# EAGLE design SensorNodePCB_set1_v2_wo_Relay (EAGLE 7.7.0)
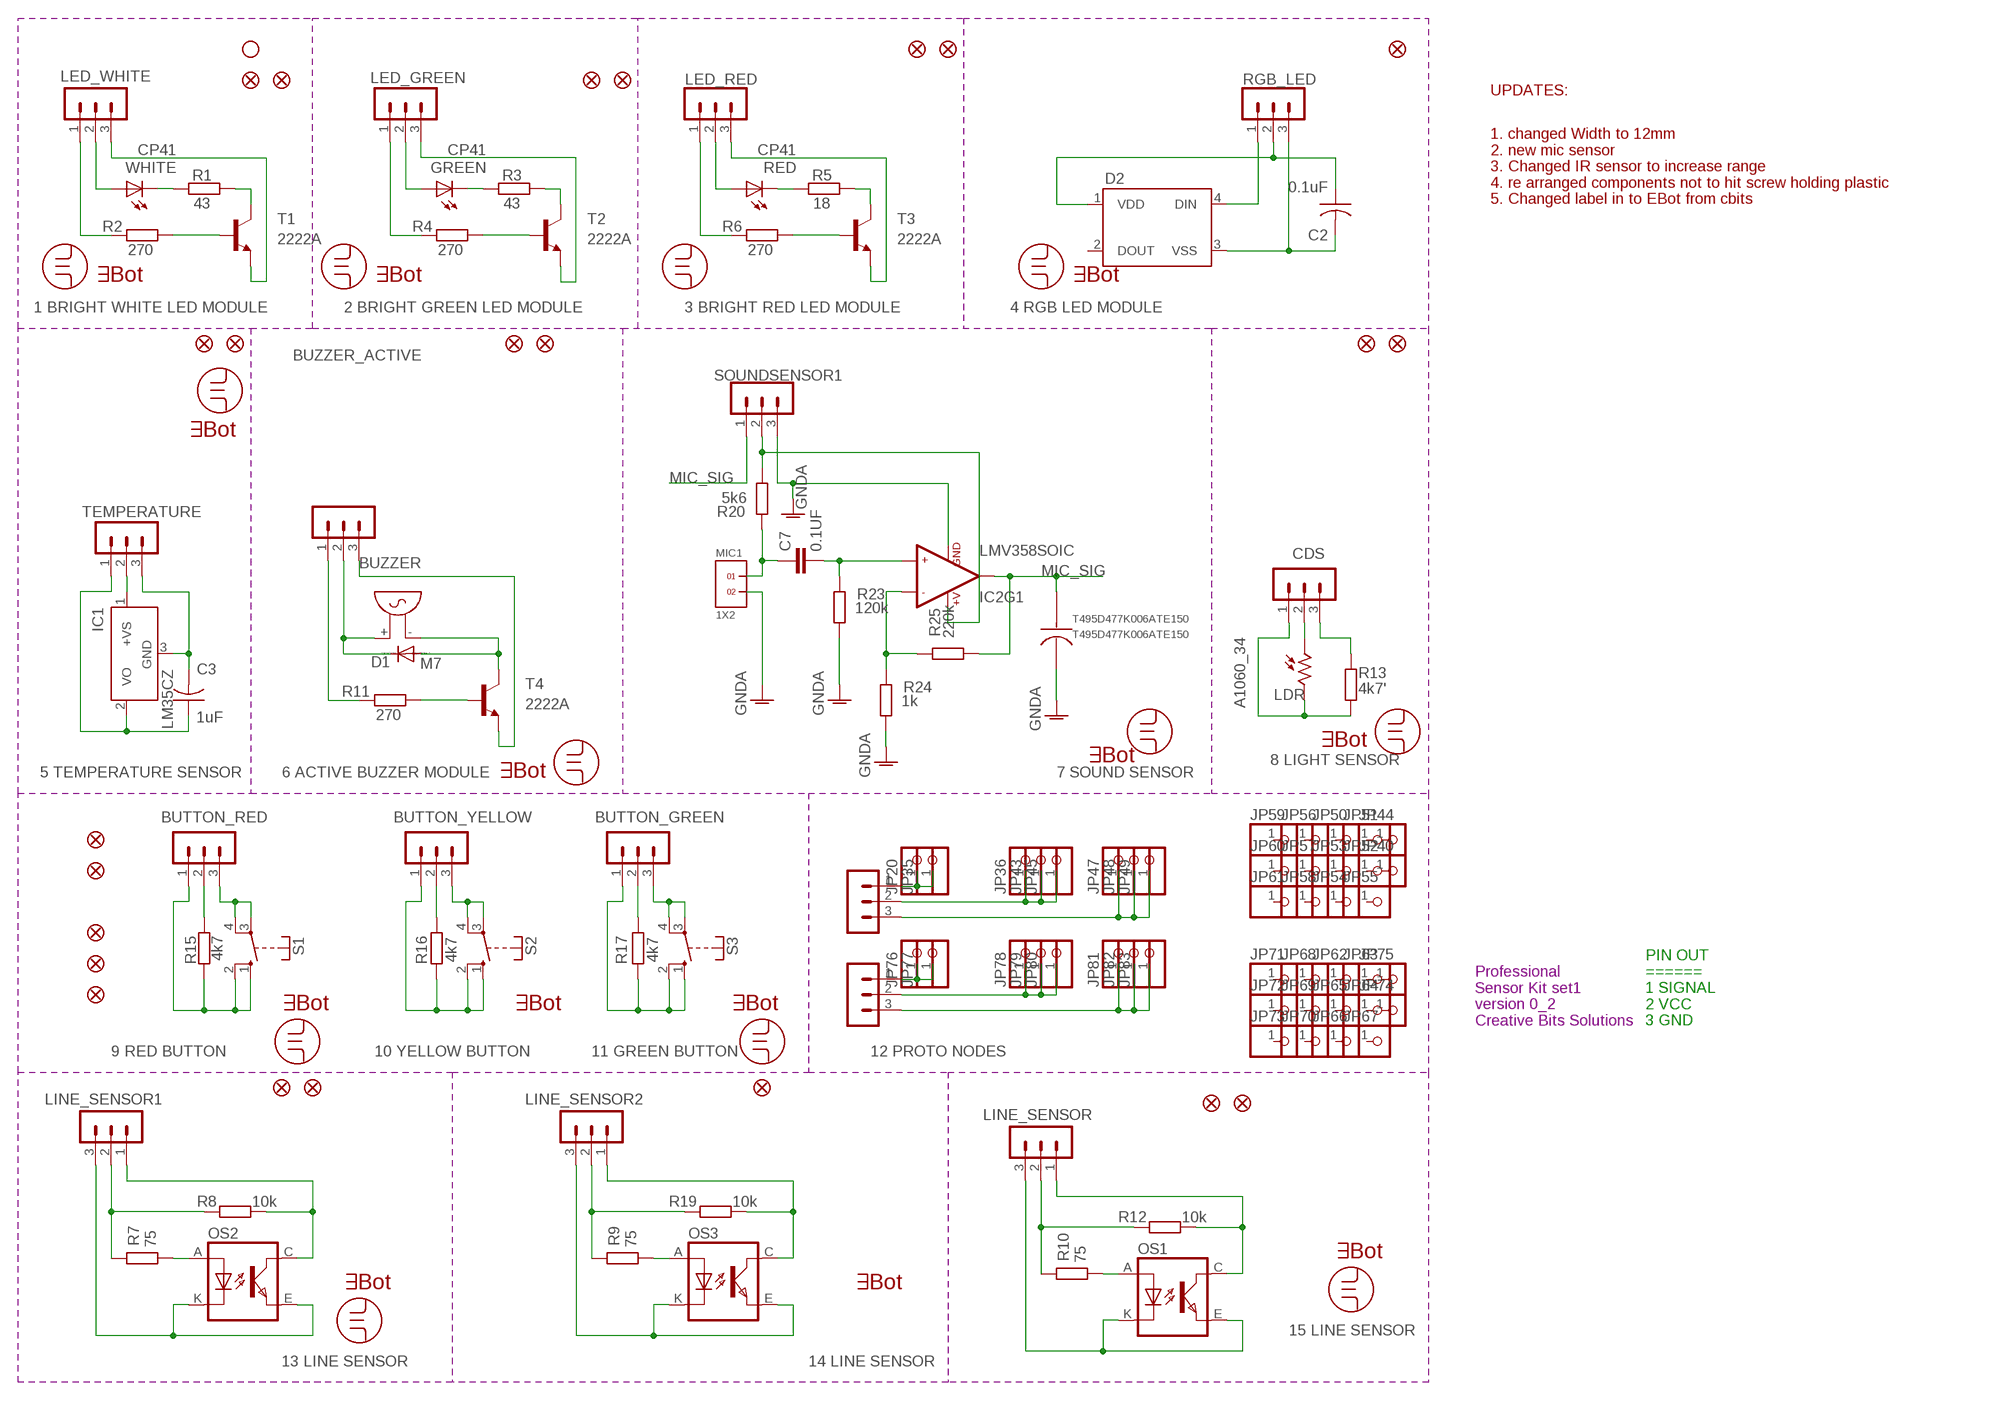
[diagram p0: schematic, sheet 1]

## Parts
BUTTON_GREEN  MA03-1  [MA03-1]
BUTTON_RED  MA03-1  [MA03-1]
BUTTON_YELLOW  MA03-1  [MA03-1]
BUZZER  F/QMX  [F/QMX]
BUZZER_ACTIVE  MA03-1  [MA03-1]
C2  0.1uF  C-USC0805  [C0805]
C3  1uF  C-USC0805  [C0805]
C7  0.1UF  CAP0805  [0805]
CDS  MA03-1  [MA03-1]
D1  M7  DIODE-DO214AC  [DO214AC]
D2  WS2812B  [WS2812B]
GREEN  CP41  LED-2AC-CP41B-WES  [CP41B]
IC1  LM35CZ  [TO92]
IC2  LMV358SOIC  [SO08]
JP1  STAND-OFF  [STAND-OFF]
JP2  FIDUCIAL1X2  [FIDUCIAL-1X2]
JP4  FIDUCIAL1X2  [FIDUCIAL-1X2]
JP6  FIDUCIAL1X2  [FIDUCIAL-1X2]
JP7  FIDUCIAL1X2  [FIDUCIAL-1X2]
JP12  FIDUCIAL1X2  [FIDUCIAL-1X2]
JP18  FIDUCIAL1X2  [FIDUCIAL-1X2]
JP19  FIDUCIAL1X2  [FIDUCIAL-1X2]
JP20  PINHD-1X1CB  [1X01-CLEANBIG]
JP23  FIDUCIAL1X2  [FIDUCIAL-1X2]
JP24  FIDUCIAL1X2  [FIDUCIAL-1X2]
JP25  FIDUCIAL1X2  [FIDUCIAL-1X2]
JP26  FIDUCIAL1X2  [FIDUCIAL-1X2]
JP28  FIDUCIAL1X2  [FIDUCIAL-1X2]
JP29  FIDUCIAL1X2  [FIDUCIAL-1X2]
JP31  FIDUCIAL1X2  [FIDUCIAL-1X2]
JP32  FIDUCIAL1X2  [FIDUCIAL-1X2]
JP33  FIDUCIAL1X2  [FIDUCIAL-1X2]
JP34  FIDUCIAL1X2  [FIDUCIAL-1X2]
JP35  PINHD-1X1CB  [1X01-CLEANBIG]
JP36  PINHD-1X1CB  [1X01-CLEANBIG]
JP37  FIDUCIAL1X2  [FIDUCIAL-1X2]
JP38  FIDUCIAL1X2  [FIDUCIAL-1X2]
JP39  FIDUCIAL1X2  [FIDUCIAL-1X2]
JP40  PINHD-1X1CB  [1X01-CLEANBIG]
JP41  FIDUCIAL1X2  [FIDUCIAL-1X2]
JP42  FIDUCIAL1X2  [FIDUCIAL-1X2]
JP43  PINHD-1X1CB  [1X01-CLEANBIG]
JP44  PINHD-1X1CB  [1X01-CLEANBIG]
JP45  PINHD-1X1CB  [1X01-CLEANBIG]
JP46  FIDUCIAL1X2  [FIDUCIAL-1X2]
JP47  PINHD-1X1CB  [1X01-CLEANBIG]
JP48  PINHD-1X1CB  [1X01-CLEANBIG]
JP49  PINHD-1X1CB  [1X01-CLEANBIG]
JP50  PINHD-1X1CB  [1X01-CLEANBIG]
JP51  PINHD-1X1CB  [1X01-CLEANBIG]
JP52  PINHD-1X1CB  [1X01-CLEANBIG]
JP53  PINHD-1X1CB  [1X01-CLEANBIG]
JP54  PINHD-1X1CB  [1X01-CLEANBIG]
JP55  PINHD-1X1CB  [1X01-CLEANBIG]
JP56  PINHD-1X1CB  [1X01-CLEANBIG]
JP57  PINHD-1X1CB  [1X01-CLEANBIG]
JP58  PINHD-1X1CB  [1X01-CLEANBIG]
JP59  PINHD-1X1CB  [1X01-CLEANBIG]
JP60  PINHD-1X1CB  [1X01-CLEANBIG]
JP61  PINHD-1X1CB  [1X01-CLEANBIG]
JP62  PINHD-1X1CB  [1X01-CLEANBIG]
JP63  PINHD-1X1CB  [1X01-CLEANBIG]
JP64  PINHD-1X1CB  [1X01-CLEANBIG]
JP65  PINHD-1X1CB  [1X01-CLEANBIG]
JP66  PINHD-1X1CB  [1X01-CLEANBIG]
JP67  PINHD-1X1CB  [1X01-CLEANBIG]
JP68  PINHD-1X1CB  [1X01-CLEANBIG]
JP69  PINHD-1X1CB  [1X01-CLEANBIG]
JP70  PINHD-1X1CB  [1X01-CLEANBIG]
JP71  PINHD-1X1CB  [1X01-CLEANBIG]
JP72  PINHD-1X1CB  [1X01-CLEANBIG]
JP73  PINHD-1X1CB  [1X01-CLEANBIG]
JP74  PINHD-1X1CB  [1X01-CLEANBIG]
JP75  PINHD-1X1CB  [1X01-CLEANBIG]
JP76  PINHD-1X1CB  [1X01-CLEANBIG]
JP77  PINHD-1X1CB  [1X01-CLEANBIG]
JP78  PINHD-1X1CB  [1X01-CLEANBIG]
JP79  PINHD-1X1CB  [1X01-CLEANBIG]
JP80  PINHD-1X1CB  [1X01-CLEANBIG]
JP81  PINHD-1X1CB  [1X01-CLEANBIG]
JP82  PINHD-1X1CB  [1X01-CLEANBIG]
JP83  PINHD-1X1CB  [1X01-CLEANBIG]
LDR  A1060_34  [T0-46-A10XX]
LED_GREEN  MA03-1  [MA03-1]
LED_RED  MA03-1  [MA03-1]
LED_WHITE  MA03-1  [MA03-1]
LINE_SENSOR  MA03-1  [MA03-1]
LINE_SENSOR1  MA03-1  [MA03-1]
LINE_SENSOR2  MA03-1  [MA03-1]
MIC1  1X2  [1X2]
OS1  TCRT5000  [TCRT5000]
OS2  TCRT5000  [TCRT5000]
OS3  TCRT5000  [TCRT5000]
R1  43  R-EU_R0805  [R0805]
R2  270  R-EU_R0805  [R0805]
R3  43  R-EU_R0805  [R0805]
R4  270  R-EU_R0805  [R0805]
R5  18  R-EU_R0805  [R0805]
R6  270  R-EU_R0805  [R0805]
R7  75  R-EU_R0805  [R0805]
R8  10k  R-EU_R0805  [R0805]
R9  75  R-EU_R0805  [R0805]
R10  75  R-EU_R0805  [R0805]
R11  270  R-EU_R0805  [R0805]
R12  10k  R-EU_R0805  [R0805]
R13  4k7'  R-EU_R0805  [R0805]
R15  4k7  R-EU_R0805  [R0805]
R16  4k7  R-EU_R0805  [R0805]
R17  4k7  R-EU_R0805  [R0805]
R19  10k  R-EU_R0805  [R0805]
R20  5k6  R-EU_R0805  [R0805]
R23  120k  R-EU_R0805  [R0805]
R24  1k  R-EU_R0805  [R0805]
R25  220k  R-EU_R0805  [R0805]
RED  CP41  LED-2AC-CP41B-WES  [CP41B]
RGB_LED  MA03-1  [MA03-1]
S1  RACON12  [RACON12]
S2  RACON12  [RACON12]
S3  RACON12  [RACON12]
SOUNDSENSOR1  MA03-1  [MA03-1]
T1  2222A  TRANSISTOR_NPNMMBT2222A  [SOT23-3]
T2  2222A  TRANSISTOR_NPNMMBT2222A  [SOT23-3]
T3  2222A  TRANSISTOR_NPNMMBT2222A  [SOT23-3]
T4  2222A  TRANSISTOR_NPNMMBT2222A  [SOT23-3]
TEMPERATURE  MA03-1  [MA03-1]
U$1  EBOT_LOGO_6MMX6MM  [EBOT_6MMX6MM]
U$3  EBOT_LOGO_6MMX6MM  [EBOT_6MMX6MM]
U$4  EBOT_LOGO_6MMX6MM  [EBOT_6MMX6MM]
U$6  EBOT_LOGO_6MMX6MM  [EBOT_6MMX6MM]
U$8  EBOT_LOGO_6MMX6MM  [EBOT_6MMX6MM]
U$9  EBOT_LOGO_6MMX6MM  [EBOT_6MMX6MM]
U$10  EBOT_LOGO_6MMX6MM  [EBOT_6MMX6MM]
U$11  T495D477K006ATE150  [T495D477K006ATE150]
U$12  EBOT_LOGO_6MMX6MM  [EBOT_6MMX6MM]
U$13  EBOT_LOGO_6MMX6MM  [EBOT_6MMX6MM]
U$14  EBOT_LOGO_6MMX6MM  [EBOT_6MMX6MM]
U$15  EBOT_LOGO_6MMX6MM  [EBOT_6MMX6MM]
U$16  EBOT_LOGO_6MMX6MM  [EBOT_6MMX6MM]
U$17  EBOT_NAME_6MM  [EBOT_NAME_6MM]
U$18  EBOT_NAME_6MM  [EBOT_NAME_6MM]
U$20  EBOT_NAME_6MM  [EBOT_NAME_6MM]
U$21  EBOT_NAME_6MM  [EBOT_NAME_6MM]
U$22  EBOT_NAME_6MM  [EBOT_NAME_6MM]
U$23  EBOT_NAME_6MM  [EBOT_NAME_6MM]
U$24  EBOT_NAME_6MM  [EBOT_NAME_6MM]
U$25  EBOT_NAME_6MM  [EBOT_NAME_6MM]
U$26  EBOT_NAME_6MM  [EBOT_NAME_6MM]
U$27  EBOT_NAME_6MM  [EBOT_NAME_6MM]
U$29  EBOT_NAME_6MM  [EBOT_NAME_6MM]
U$30  EBOT_NAME_6MM  [EBOT_NAME_6MM]
U$31  EBOT_NAME_6MM  [EBOT_NAME_6MM]
ULTRASONICSENSOR1  MA03-1  [MA03-1]
ULTRASONICSENSOR2  MA03-1  [MA03-1]
WHITE  CP41  LED-2AC-CP41B-WES  [CP41B]

## Nets
GNDA: IC2.4(GND) MIC1.2 R23.1 R24.1 SOUNDSENSOR1.3 U$11.-
MIC_SIG: IC2.1(OUT1) R25.1 SOUNDSENSOR1.1 U$11.+
N$1: LED_WHITE.1 R2.2
N$2: R2.1 T1.1(B)
N$3: R1.2 WHITE.1(C) WHITE.4(C)
N$4: R1.1 T1.3(C)
N$5: R4.1 T2.1(B)
N$6: LED_WHITE.2 WHITE.2(A) WHITE.3(A)
N$7: GREEN.1(C) GREEN.4(C) R3.2
N$8: LED_GREEN.1 R4.2
N$9: R3.1 T2.3(C)
N$10: GREEN.2(A) GREEN.3(A) LED_GREEN.2
N$11: R6.1 T3.1(B)
N$12: R5.2 RED.1(C) RED.4(C)
N$13: LED_RED.1 R6.2
N$14: R5.1 T3.3(C)
N$15: LED_RED.2 RED.2(A) RED.3(A)
N$16: D2.4(DIN) RGB_LED.1
N$17: C2.1 D2.1(VDD) RGB_LED.2
N$18: C2.2 D2.3(VSS) RGB_LED.3
N$19: BUTTON_RED.1 R15.2 S1.1(S) S1.2(S)
N$20: BUTTON_RED.2 R15.1
N$21: BUTTON_YELLOW.1 R16.2 S2.1(S) S2.2(S)
N$22: LED_WHITE.3 T1.2(E)
N$23: JP20.1 JP35.1 ULTRASONICSENSOR1.1
N$24: R11.1 T4.1(B)
N$25: LED_GREEN.3 T2.2(E)
N$26: LED_RED.3 T3.2(E)
N$27: IC1.1(+VS) TEMPERATURE.2
N$28: BUZZER_ACTIVE.1 R11.2
N$29: BUZZER.- D1.A T4.3(C)
N$30: BUZZER.+ BUZZER_ACTIVE.2 D1.C
N$31: BUZZER_ACTIVE.3 T4.2(E)
N$32: C3.2 IC1.3(GND) TEMPERATURE.3
N$33: C3.1 IC1.2(VO) TEMPERATURE.1
N$34: LINE_SENSOR.3 OS1.E(EMITTER) OS1.K(CATHODE)
N$35: LINE_SENSOR.2 R10.1 R12.1
N$36: OS1.A(ANODE) R10.2
N$37: CDS.1 LDR.2 R13.2
N$38: CDS.2 LDR.1
N$39: CDS.3 R13.1
N$40: LINE_SENSOR.1 OS1.C(COLLECTOR) R12.2
N$41: JP36.1 JP43.1 JP45.1 ULTRASONICSENSOR1.2
N$42: JP47.1 JP48.1 JP49.1 ULTRASONICSENSOR1.3
N$43: JP76.1 JP77.1 ULTRASONICSENSOR2.1
N$44: BUTTON_GREEN.1 R17.2 S3.1(S) S3.2(S)
N$46: BUTTON_GREEN.3 S3.3(P) S3.4(P)
N$47: JP78.1 JP79.1 JP80.1 ULTRASONICSENSOR2.2
N$48: BUTTON_YELLOW.2 R16.1
N$49: JP81.1 JP82.1 JP83.1 ULTRASONICSENSOR2.3
N$50: BUTTON_GREEN.2 R17.1
N$57: LINE_SENSOR1.3 OS2.E(EMITTER) OS2.K(CATHODE)
N$58: LINE_SENSOR1.2 R7.1 R8.1
N$59: LINE_SENSOR1.1 OS2.C(COLLECTOR) R8.2
N$62: OS2.A(ANODE) R7.2
N$63: LINE_SENSOR2.3 OS3.E(EMITTER) OS3.K(CATHODE)
N$64: LINE_SENSOR2.2 R9.1 R19.1
N$65: LINE_SENSOR2.1 OS3.C(COLLECTOR) R19.2
N$66: OS3.A(ANODE) R9.2
N$67: BUTTON_YELLOW.3 S2.3(P) S2.4(P)
N$68: IC2.8(+V) R20.1 SOUNDSENSOR1.2
N$69: C7.1 MIC1.1 R20.2
N$70: BUTTON_RED.3 S1.3(P) S1.4(P)
N$71: C7.2 IC2.3(+IN1) R23.2
N$72: IC2.2(-IN1) R24.2 R25.2
Unconnected: D2.2(DOUT) IC2.5(+IN2) IC2.6(-IN2) IC2.7(OUT2) JP40.1 JP44.1 JP50.1 JP51.1 JP52.1 JP53.1 JP54.1 JP55.1 JP56.1 JP57.1 JP58.1 JP59.1 JP60.1 JP61.1 JP62.1 JP63.1 JP64.1 JP65.1 JP66.1 JP67.1 JP68.1 JP69.1 JP70.1 JP71.1 JP72.1 JP73.1 JP74.1 JP75.1

## Notes on the sheet
- UPDATES:
- 1. changed Width to 12mm
  2. new mic sensor
  3. Changed IR sensor to increase range
  4. re arranged components not to hit screw holding plastic
  5. Changed label in to EBot from cbits
- 1 BRIGHT WHITE LED MODULE | 2 BRIGHT GREEN LED MODULE | 3 BRIGHT RED LED MODULE | 4 RGB LED MODULE
- 8 LIGHT SENSOR
- 5 TEMPERATURE SENSOR | 6 ACTIVE BUZZER MODULE | 7 SOUND SENSOR
- Professional
  Sensor Kit set1
  version 0_2
  Creative Bits Solutions
- PIN OUT
  ======
  1 SIGNAL
  2 VCC
  3 GND
- 9 RED BUTTON | 10 YELLOW BUTTON | 11 GREEN BUTTON | 12 PROTO NODES
- 15 LINE SENSOR
- 13 LINE SENSOR | 14 LINE SENSOR

## Library data of the parts
BUTTON_GREEN BUTTON_RED BUTTON_YELLOW BUZZER_ACTIVE CDS LED_GREEN LED_RED LED_WHITE LINE_SENSOR LINE_SENSOR1 LINE_SENSOR2 RGB_LED SOUNDSENSOR1 TEMPERATURE ULTRASONICSENSOR1 ULTRASONICSENSOR2 = con-lstb:MA03-1: PIN HEADER; OC_FARNELL: unknown; OC_NEWARK: unknown
BUZZER = buzzer:F/QMX: BUZZER Source: Buerklin; OC_FARNELL: unknown; OC_NEWARK: unknown
C2 C3 = adafruit:C-US: CAPACITOR, American symbol
C7 = SparkFun:CAP: Capacitor Standard 0603 ceramic capacitor, and 0.1" leaded capacitor.
D1 = diode:DIODE-: DIODE
D2 = WS2812BSparkFun-LED:WS2812B: WS2812B - Intelligent control LED integrated light source Technical Specifications: Power Supply Voltage (VDD): 3.5 to 5.3 V Input Voltage (VI): -0.5 to VDD+0.5 V Operating Junction Temperature (Topt): -25°C to +80°C Storage Temperature Range (Tstg): -55°C to +150°C; PROD_ID: DIO-12503
GREEN RED WHITE = led:LED-2AC-: LEDs with 2 Cathode & 2 Anode - Kingbright SUPER FLUX LED LAMP Source: www.us.kingbright.com/images/catalog/SPEC/W7676CPBC-H.pdf Cree® P4 LED CP41B-WES/WGS Source: Data sheet <http://www.cree.com/products/pdf/LEDlamps/CP41B-WES&WGS.pdf>
IC1 = lm35:LM35: Single-Supply Centigrade Temperature Sensor Vout = (10mV/°C x Temp °C) +5mmmV Source: http://www.national.com/ds/LM/LM35.pdf
IC2 = SparkFun-AnalogIC:LMV358: Jellybean rail-to-rail output op-amp; PROD_ID: IC-09657
JP1 = WS2812BSparkFun:STAND-OFF: Stand Off This is the mechanical footprint for a #4 phillips button head screw. Use the keepout ring to avoid running the screw head into surrounding components. SKU : PRT-00447
JP2 JP4 JP6 JP7 JP12 JP18 JP19 JP23-JP26 JP28 JP29 JP31-JP34 JP37-JP39 JP41 JP42 JP46 = attiny84SparkFun:FIDUCIAL: Fiducial Alignment Points Various fiducial points for machine vision alignment.
JP20 JP35 JP36 JP40 JP43-JP45 JP47-JP83 = adafruit:PINHD-1X1: Pin header 1x1 for 0.1" spacing With round pins
LDR = photo-elements:A10: Sensor Robust Light Sensing Applications Outdoor Light Sensing Application Source: http://optoelectronics.perkinelmer.com/content/Datasheets/DTS_PhotocellsA1050.pdf
MIC1 = headers(.1in):1X2
OS1-OS3 = tcrt5000:TCRT5000
R1-R13 R15-R17 R19 R20 R23-R25 = resistor:R-EU_: RESISTOR, European symbol
S1-S3 = switch-misc:RACON12: ITT SWITCH
T1-T4 = SparkFun-DiscreteSemi:TRANSISTOR_NPN: Generic NPN BJT MMBT2222A - TRANS-08049 (SOT-23, 1A 40V) MPSA42 - TRANS-09116 (SOT-23, 500mA 300V) MMBT5088LT1G - TRANS-11160 (SOT-23, 50 mA 30V) BC547 - COM-08928 <http://www.sparkfun.com/products/8928> (TO-92 45V 100mA) (1.Collector 2.Base 3.Emitter) 2N3904 - COM-00521 <http://www.sparkfun.com/products/521> (TO-92 40V 200mA) (1.Emitter 2.Base 3.Collector) P2N2222A - COM-12852 <http://www.sparkfun.com/products/12852> (TO-92 40V 600mA) (1.Collector 2.Base 3.Emitter); PROD_ID: TRANS-08049; VALUE: MMBT2222A
U$1 U$3 U$4 U$6 U$8-U$10 U$12-U$16 = EbotLogos:EBOT_LOGO_6MMX6MM
U$11 = creativeBits:T495D477K006ATE150
U$17 U$18 U$20-U$27 U$29-U$31 = EbotLogos:EBOT_NAME_6MM

## Net classes
0 default: width 0.178 mm, drill 0.305 mm, clearance 0.178 mm

## Board
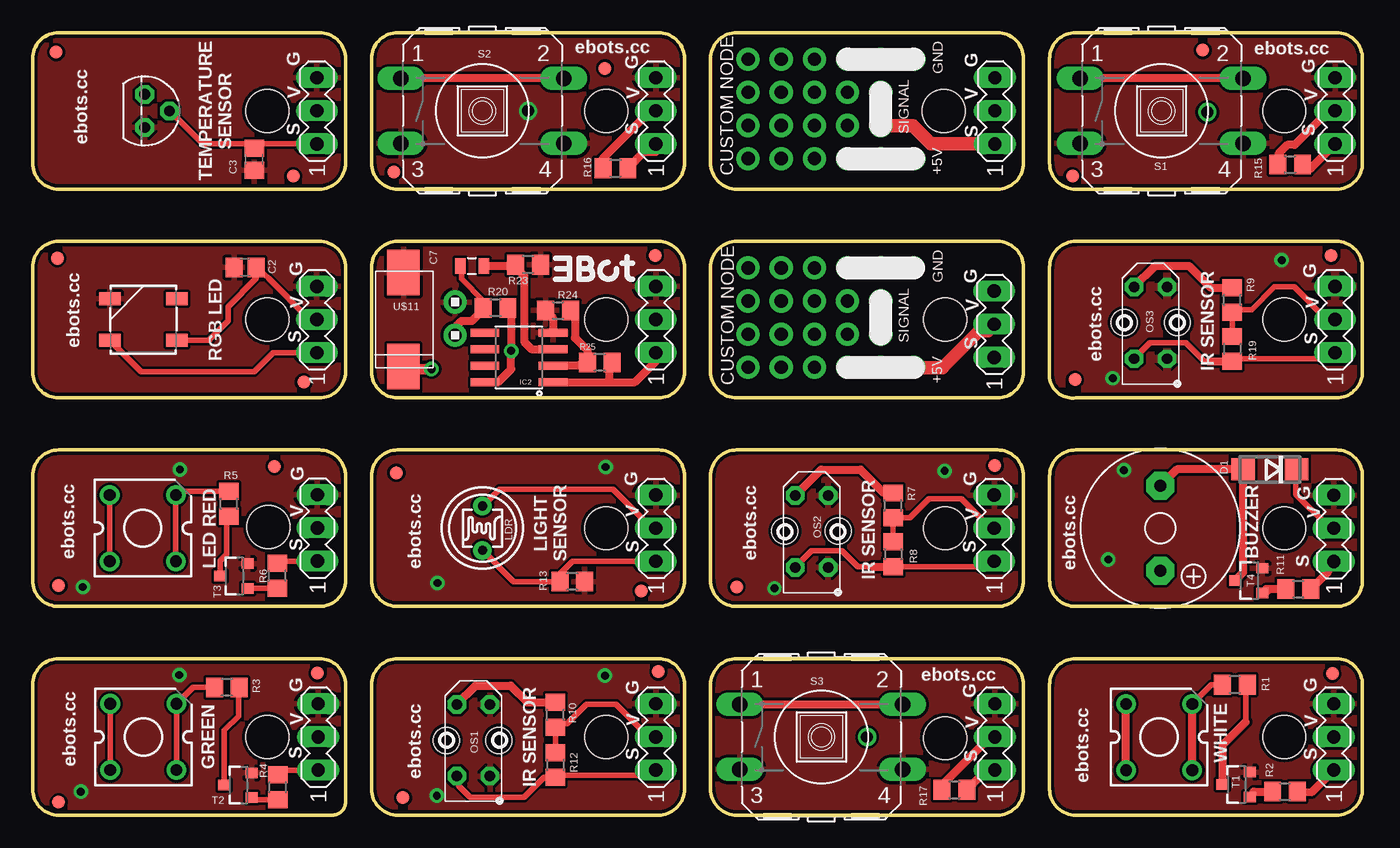
[diagram p1: board, top side]
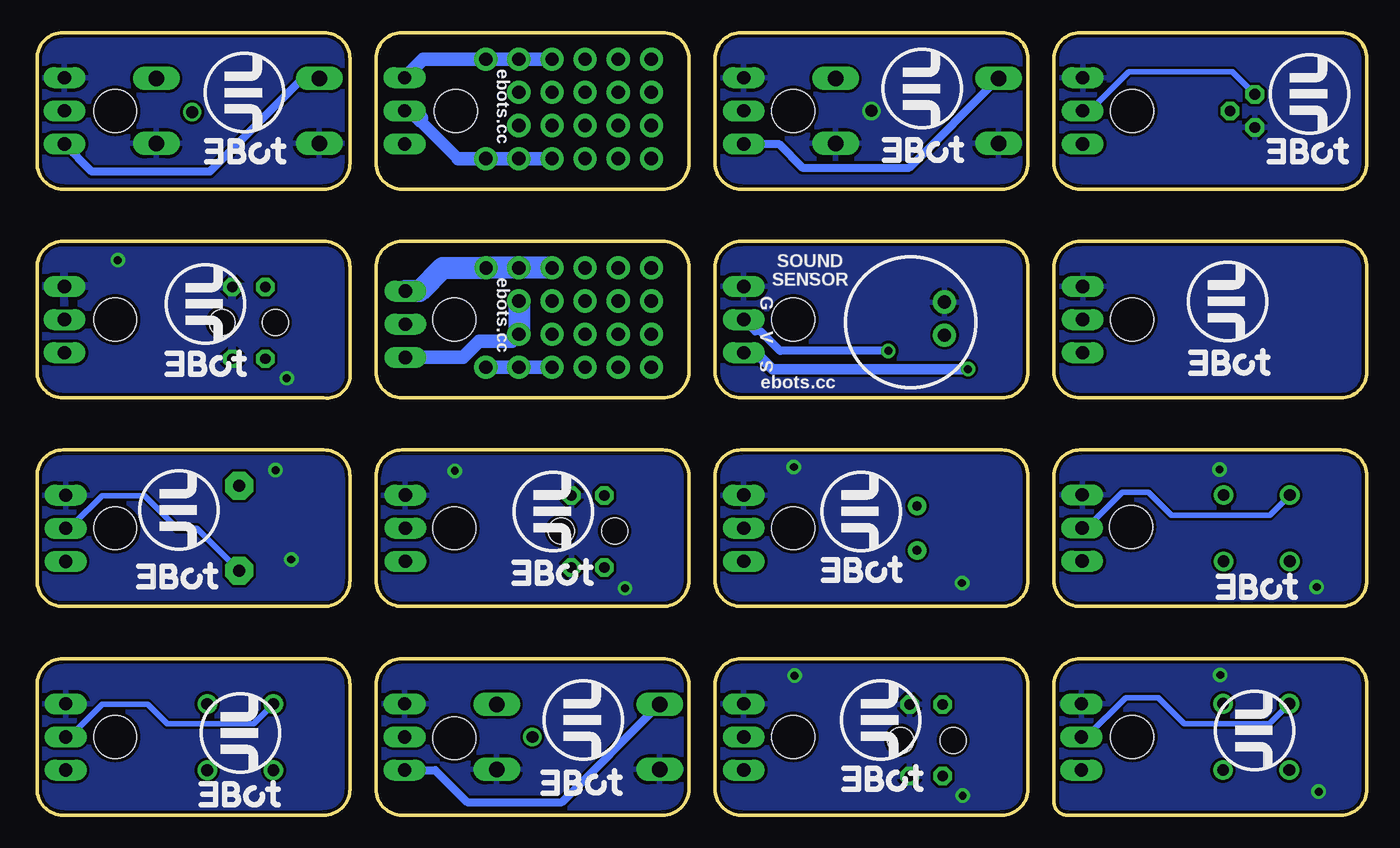
[diagram p2: board, bottom side, seen from below]

Size 102 x 60 mm. Coordinates in mm from the lower left corner, seen from the top.
Outline: 102,34 arc-90 100,32 80,32 arc-90 78,33.5 78,42 arc-90 80,44 100,44 arc-90 102,42 102,34
Outline: 78,2 78,10 arc-90 80,12 100,12 arc-90 102,10 102,2 arc-90 100,0 80,0 arc-90 78,2
Outline: 0,2 0,10 arc-90 2,12 22,12 arc-90 24,10 24,1 arc-90 23,0 2,0 arc-90 0,2
Outline: 0,18 0,26 arc-90 2,28 22,28 arc-90 24,26 24,18 arc-90 22,16 2,16 arc-90 0,18
Outline: 0,34 0,42 arc-90 2,44 22,44 arc-90 24,42 24,34 arc-90 22,32 2,32 arc-90 0,34
Outline: 26,34 26,42 arc-90 28,44 48,44 arc-90 50,42 50,34 arc-90 48,32 28,32 arc-90 26,34
Outline: 52,2 52,10 arc-90 54,12 74,12 arc-90 76,10 76,2 arc-90 74,0 54,0 arc-90 52,2
Outline: 26,50 26,58 arc-90 28,60 48,60 arc-90 50,58 50,50 arc-90 48,48 28,48 arc-90 26,50
Outline: 78,50 78,58 arc-90 80,60 100,60 arc-90 102,58 102,50 arc-90 100,48 80,48 arc-90 78,50
Outline: 28,28 48,28 arc-90 50,26 50,18 arc-90 48,16 28,16 arc-90 26,18 26,26 arc-90 28,28
Outline: 28,12 48,12 arc-90 50,10 50,2 arc-90 48,0 28,0 arc-90 26,2 26,10 arc-90 28,12
Outline: 100,28 80,28 arc90 78,26 78,18 arc90 80,16 100,16 arc90 102,18 102,26 arc90 100,28
Outline: 22,48 2,48 arc-90 0,50 0,58 arc-90 2,60 22,60 arc-90 24,58 24,50 arc-90 22,48
Outline: 74,16 54,16 arc-90 52,18 52,26 arc-90 54,28 74,28 arc-90 76,26 76,18 arc-90 74,16
Outline: 76,34 76,42 arc90 74,44 54,44 arc90 52,42 52,34 arc90 54,32 74,32 arc90 76,34
Outline: 74,60 54,60 arc90 52,58 52,50 arc90 54,48 74,48 arc90 76,50 76,58 arc90 74,60
Copper layers (1*16): Top 0.035mm / dielectric 1.5mm / Bottom 0.035mm
Design rules "SparkFun": minimum track width 8mil, minimum drill 20mil, track to track 8mil, track to pad 8mil, pad to pad 8mil, via to via 8mil, smd to smd 8mil, copper to edge 10mil, drill to drill 8mil, minimum pad ring 12mil, minimum via ring 10mil, stop-mask expansion 4mil, vias tented up to drill 25mil, thermal gap 10mil
Holes 2 mm at 57.7,21.79 61.79,21.79 83.71,37.77 87.8,37.77 31.74,5.74 35.75,5.74

### Footprints (pad centres in the part's own frame; a part is rotated, then mirrored left to right if it is on the bottom)
MA03-1 = drill 1.016 long: 1 -2.54,0; 2 0,0; 3 2.54,0
F/QMX = drill 0.914 pad 2.159 octagon: + 3.251,0; - -3.251,0
C0805 = smd 1.3 x 1.5: 1 -0.85,0; 2 0.85,0
0805 = smd 0.8 x 1.2: 1 -0.9,0; 2 0.9,0
DO214AC = smd 1.8 x 1.7: A 2.05,0; C -2.05,0
WS2812B = smd 1.651 x 1: 1 -2.577,1.6; 2 -2.577,-1.6; 3 2.577,-1.6; 4 2.577,1.6
CP41B = drill 0.9 pad 1.27: 1 -2.54,2.54; 2 -2.54,-2.54; 3 2.54,-2.54; 4 2.54,2.54
TO92 = drill 0.813 octagon: 1 -1.27,0; 2 0,1.905; 3 1.27,0
SO08 = smd 0.61 x 2.21: 1 -1.905,-2.616; 2 -0.635,-2.616; 3 0.635,-2.616; 4 1.905,-2.616; 5 1.905,2.616; 6 0.635,2.616; 7 -0.635,2.616; 8 -1.905,2.616
STAND-OFF = hole 3.302: 0,0
FIDUCIAL-1X2 = smd 1 x 1: 1 0,0
1X01-CLEANBIG = drill 1.016 pad 1.778: 1 0,0
T0-46-A10XX = drill 0.7 pad 1.4: 1 -1.7,0; 2 1.7,0
1X2 = drill 1.016 pad 1.778: 1 0,0; 2 2.54,0
TCRT5000 = drill 0.8 octagon: A -2.496,-1.27; C 3.004,-1.27; E 3.004,1.27; K -2.496,1.27
R0805 = smd 1.3 x 1.5: 1 -0.95,0; 2 0.95,0
RACON12 = drill 1.194 long: 1 -6.248,2.489; 2 6.248,2.489; 3 -6.248,-2.489; 4 6.248,-2.489
SOT23-3 = smd 0.8 x 0.9: 1 -0.95,-1; 2 0.95,-1; 3 0,1.1
T495D477K006ATE150 = smd 3.5 x 2.5: + 3.61,-0.06; - -3.6,-0.05

### Placement (x,y rotation side)
BUTTON_GREEN  73.8,6 90 top
BUTTON_RED  99.9,54 90 top
BUTTON_YELLOW  47.8,54 90 top
BUZZER  86.5,22 270 top
BUZZER_ACTIVE  99.8,21.99 90 top
C2  16.3,42 180 top
C3  17,50.3 270 top
C7  33.7,42.1 0 top
CDS  47.8,22 90 top
D1  94.88,26.51 180 top
D2  8.5,38 180 top
GREEN  8.5,6 270 top
IC1  8.6,54 270 top
IC2  37.3,35.1 90 top
JP1  96,6 90 top
JP2  1.8,58.5 0 top
JP3  STAND-OFF  [STAND-OFF]  18,38 90 top
JP4  20,49 0 top
JP5  STAND-OFF  [STAND-OFF]  69.87,54 180 top
JP6  43.9,57.25 0 top
JP7  27.7,49.3 0 top
JP8  STAND-OFF  [STAND-OFF]  70,38 180 top
JP9  STAND-OFF  [STAND-OFF]  96,38 90 top
JP10  STAND-OFF  [STAND-OFF]  70,5.9 90 top
JP11  STAND-OFF  [STAND-OFF]  44,22 90 top
JP12  1.9,42.7 0 top
JP13  STAND-OFF  [STAND-OFF]  96,22 90 top
JP14  STAND-OFF  [STAND-OFF]  44,54 90 top
JP15  STAND-OFF  [STAND-OFF]  96,54 90 top
JP16  STAND-OFF  [STAND-OFF]  44,38 90 top
JP17  STAND-OFF  [STAND-OFF]  18,54 90 top
JP18  20.8,33.2 0 top
JP19  47.75,42.9 0 top
JP20  65.04,55.42 0 top
JP21  STAND-OFF  [STAND-OFF]  18,6 90 top
JP22  STAND-OFF  [STAND-OFF]  18.1,22.1 90 top
JP23  18.55,26.75 90 top
JP24  2,17.6 90 top
JP25  27.9,26.25 90 top
JP26  46.7,17.2 90 top
JP27  STAND-OFF  [STAND-OFF]  44,6 90 top
JP28  21.85,10.9 90 top
JP29  2,1 90 top
JP30  STAND-OFF  [STAND-OFF]  70,22 180 top
JP31  54,17.5 0 top
JP32  73.8,26.8 0 top
JP33  28.4,1.35 90 top
JP34  48,11 90 top
JP35  65.04,52.88 0 top
JP36  65.04,50.34 0 top
JP37  99.7,10.85 90 top
JP38  89.75,58.65 90 top
JP39  79.75,49 90 top
JP40  62.5,55.42 0 top
JP41  99.6,42.9 90 top
JP42  79.95,33.4 90 top
JP43  67.58,50.34 0 top
JP44  62.5,52.88 0 top
JP45  62.5,50.34 0 top
JP46  48,11 0 top
JP47  62.5,57.96 0 top
JP48  65.04,57.96 0 top
JP49  67.58,57.96 0 top
JP50  54.88,52.88 0 top
JP51  57.42,50.34 0 top
JP52  54.88,57.96 0 top
JP53  59.96,57.96 0 top
JP54  59.96,55.42 0 top
JP55  59.96,50.34 0 top
JP56  59.96,52.88 0 top
JP57  54.88,55.42 0 top
JP58  57.42,55.42 0 top
JP59  54.88,50.34 0 top
JP60  57.42,57.96 0 top
JP61  57.42,52.88 0 top
JP62  54.88,36.88 0 top
JP63  54.88,39.42 0 top
JP64  57.42,34.34 0 top
JP65  54.88,34.34 0 top
JP66  54.88,41.96 0 top
JP67  59.96,34.34 0 top
JP68  57.42,41.96 0 top
JP69  57.42,36.88 0 top
JP70  59.96,41.96 0 top
JP71  59.96,39.42 0 top
JP72  59.96,36.88 0 top
JP73  57.42,39.42 0 top
JP74  62.5,39.42 0 top
JP75  62.5,36.88 0 top
JP76  65.04,36.88 0 top
JP77  65.04,39.42 0 top
JP78  62.5,34.34 0 top
JP79  67.58,34.34 0 top
JP80  65.04,34.34 0 top
JP81  62.5,41.96 0 top
JP82  67.55,41.96 0 top
JP83  65.04,41.96 0 top
LDR  34.5,22 270 top
LED_GREEN  21.9,6 90 top
LED_RED  21.84,22.02 90 top
LED_WHITE  99.8,6 90 top
LINE_SENSOR  47.8,6 90 top
LINE_SENSOR1  73.75,22 90 top
LINE_SENSOR2  99.9,38 90 top
MIC1  32.4,36.8 90 top
OS1  33.8,6 270 top
OS2  59.75,22 270 top
OS3  85.75,38 270 top
R1  92.2,10 180 top
R2  96.05,1.8 0 top
R3  14.9,9.8 180 top
R4  18.8,2.15 90 top
R5  15.07,23.87 90 top
R6  18.77,18.36 90 top
R7  66,23.75 90 top
R8  66,20 270 top
R9  92,39.5 90 top
R10  40.1,7.7 90 top
R11  97.07,17.33 0 top
R12  40.1,3.85 270 top
R13  41.4,17.9 180 top
R15  96.45,49.9 0 top
R16  44.7,49.6 0 top
R17  70.7,1.95 0 top
R19  92,35.75 270 top
R20  35.5,38.9 180 top
R23  38,42.2 180 top
R24  40.3,38.7 0 top
R25  43.5,34.7 180 top
RED  8.45,22 270 top
RGB_LED  21.8,38 90 top
S1  86.6,54 0 top
S2  34.5,54 0 top
S3  60.5,6 0 top
SOUNDSENSOR1  47.8,38 90 top
T1  92.35,2.35 90 top
T2  15.8,2.3 90 top
T3  15.49,18.34 90 top
T4  93.32,17.98 90 top
TEMPERATURE  21.8,54 90 top
U$1  34.1,55.7 0 bottom
U$3  86.1,55.4 0 bottom
U$4  89.1,39.2 0 bottom
U$6  10.7,39.4 0 bottom
U$8  38.8,23.3 0 bottom
U$9  62.4,23.3 0 bottom
U$10  91.1,23.4 0 bottom
U$11  28.5,38 270 top
U$12  8.6,6.5 0 bottom
U$13  37.3,7.3 0 bottom
U$14  60.1,7.3 0 bottom
U$15  86.4,6.3 0 bottom
U$16  4.4,55.3 0 bottom
U$17  7.5,50 0 bottom
U$18  37,50.1 0 bottom
U$20  89,50 0 bottom
U$21  92,33.7 0 bottom
U$22  40.1,41 0 top
U$23  13.5,33.8 0 bottom
U$24  11.4,16.6 0 bottom
U$25  41.7,17.9 0 bottom
U$26  65.4,17.7 0 bottom
U$27  94.2,17.4 0 bottom
U$29  40.1,1.9 0 bottom
U$30  63.2,1.6 0 bottom
U$31  89.4,0.7 0 bottom
ULTRASONICSENSOR1  73.8,54 90 top
ULTRASONICSENSOR2  73.75,37.64 90 top
WHITE  86.4,5.99 270 top

### Tracks (layer width: path | path; a pad name or v marks a point on that pad's centre or on a via)
GNDA
  Top 0.61: R24.1 39.92,38.13 IC2.4
  pour Bottom: 26.5,45 26.3,31 50.1,31.1 50,44.7
  pour Top: 26,31 26.3,44.9 49.8,44.7 50,30.9
MIC_SIG  (via drill 0.6)
  Top 0.61: IC2.1 39.52,33.2 44.2,33.2 | 44.2,33.2 46.2,33.2 47.8,34.8 SOUNDSENSOR1.1 | R25.1 44.2,34.45 44.2,33.2
  Top 0.813: U$11.+ 28.73,34.2 v30.6,34.2
  Bottom 0.813: v30.6,34.2 45.6,34.2 46.86,35.46 SOUNDSENSOR1.1
N$1
  Top 0.406: 99.44,3.1 LED_WHITE.1
  Top 0.61: R2.2 98.1,1.76 LED_WHITE.1
N$2
  Top 0.61: T1.1 93.65,1.8 R2.1
N$3
  Top 0.406: R1.2 90.41,10 WHITE.1
  Top 0.61: WHITE.4 WHITE.1
N$4
  Top 0.406: 93.05,7.15 93.05,9.9 R1.1
  Top 0.61: 93.05,7.15 91.25,5.35 T1.3
N$5
  Top 0.406: T2.1 16.95,1.2 R4.1
N$6
  Top 0.61: WHITE.3 WHITE.2
  Bottom 0.406: WHITE.2 85.39,7 92,7 93.5,8.5 97,8.5 99.25,6.25 99.55,6.25 LED_WHITE.2
N$7
  Top 0.406: GREEN.4 GREEN.1 12.3,9.8 R3.2
N$8
  Top 0.406: R4.2 19.16,3.46 LED_GREEN.1
N$9
  Top 0.406: R3.1 15.8,9.75 15.8,7.6 14.7,6.5 T2.3
N$10
  Top 0.406: GREEN.3 GREEN.2
  Bottom 0.406: GREEN.2 7.5,7 14,7 16,9 18.5,9 21.5,6 LED_GREEN.2
N$11
  Top 0.406: T3.1 16.51,17.41 R6.1
N$12
  Top 0.406: RED.4 RED.1 11.27,24.82 R5.2
N$13
  Top 0.406: R6.2 18.74,19.48 LED_RED.1
N$14
  Top 0.406: R5.1 14.9,22.75 14.9,20 14.39,19.49 T3.3
N$15
  Top 0.406: RED.3 RED.2
  Bottom 0.406: 22.02,22 LED_RED.2 21.61,22.25 21.25,22.25 18.75,24.75 16.75,24.75 15,23 7.45,23 RED.2
N$16
  Top 0.406: D2.4 8.32,34 17,34 18.46,35.46 RGB_LED.1
N$17
  Top 0.406: RGB_LED.2 21.25,38 18.1,41.15 C2.1 17.15,41.15 15,39 15,37.9 13.6,36.5 13.6,36.4 D2.1
N$18
  pour Bottom: 0,31 -0.1,45.1 24.1,44.7 24,30.9
  pour Top: 0.1,45 0,31 23.8,31.1 23.7,44.9
N$19
  Top 0.406: 100.05,51.51 BUTTON_RED.1 100.1,51.3
  Top 0.61: R15.2 98.04,49.6 BUTTON_RED.1 | S1.2 S1.1
  Bottom 0.61: S1.1 81.61,56.49 88.75,49.35 97.79,49.35 BUTTON_RED.1
N$20
  Top 0.61: BUTTON_RED.2 99.4,54 96.8,51.4 96.25,51.4 95.55,50.7 95.55,49.65 R15.1
N$21
  Top 0.61: S2.2 S2.1 | BUTTON_YELLOW.1 47.8,50.85 46.9,50.85 R16.2
  Bottom 0.61: BUTTON_YELLOW.1 45.11,51.46 43.3,49.65 35.09,49.65 S2.1
N$22
  pour Top: 78.1,-1 78.3,12.9 102.1,12.9 102.1,-1
  pour Bottom: 77.9,12.9 77.9,-1 102.1,-1.2 102.1,13
N$23
  Top 1.016: ULTRASONICSENSOR1.1 68.9,51.46 67.5,52.85 65.06,52.85 JP35.1 JP20.1
N$24
  Top 0.406: T4.1 94.72,17.08
  Top 0.61: R11.1 94.62,17.33 T4.1
N$25  (via drill 0.6)
  other vias: 3.7,1.8 11.25,10.75
  pour Top: 0.1,-1.1 -0.1,13.2 24,13 24,-1.2
  pour Bottom: 0.2,13.3 -0.1,-1 24,-1.1 24.2,13.1
N$26  (via drill 0.6)
  other vias: 3.85,17.5 11.3,26.5
  pour Top: 0.1,15 0.2,29.1 23.8,28.8 24.2,14.8
  pour Bottom: -0.1,28.7 0.2,14.9 23.9,14.8 23.8,29
N$27
  Bottom 0.406: IC1.1 10.33,57 11,57 12,57 18.25,57 21.25,54 TEMPERATURE.2
N$28
  Top 0.406: 100.08,19.37 BUZZER_ACTIVE.1 99.37,19.02
  Top 0.61: 99.37,19.02 99.37,18.68 R11.2
N$29
  Top 0.406: 92.78,18.54 T4.3
  Top 0.61: 87.26,26.01 BUZZER.- 87.76,26.51 D1.A 92.83,18.59 T4.3
N$30
  Top 0.406: D1.C 96.88,24.62 99.25,22.25 99.54,22.25 BUZZER_ACTIVE.2
  Bottom 0.406: BUZZER.+ 89.74,21.99 91.24,21.99 93.75,24.5 97,24.5 99.25,22.25 99.54,22.25 BUZZER_ACTIVE.2
N$31  (via drill 0.6)
  other vias: 83.7,26.45 82.5,19.6
  pour Top: 78,15.3 77.9,28.5 102.1,28.8 101.9,14.9
  pour Bottom: 78.1,28.7 78,15.3 102.2,15 101.9,29.1
N$32
  pour Top: -0.3,47.2 -0.3,60.7 23.7,60.9 24,47.3
  pour Bottom: 0.1,60.9 -0.1,47.2 23.9,47.1 23.7,60.6
N$33
  Top 0.406: IC1.2 13.04,51.46 TEMPERATURE.1 | 20.01,51.46 TEMPERATURE.1 | C3.1 17.31,51.46 TEMPERATURE.1
N$34  (via drill 0.6)
  other vias: 31,1.5 43.9,10.7
  pour Top: 25.9,-0.6 26,12.9 50,13 49.8,-1
  pour Bottom: 25.9,13 26.3,-0.7 50,-0.9 50.1,12.8
N$35
  Top 0.406: LINE_SENSOR.2 47.55,6.25 47,6.25 44.75,8.5 42.5,8.5 41,7 40.35,7 R10.1 R12.1
N$36
  Top 0.406: 40.05,8.65 R10.2
  Top 0.61: OS1.A 33.96,9.93 36.67,9.93 37.95,8.65 R10.2
N$37
  Top 0.406: CDS.1 41.4,19.46 40.45,18.51 R13.2 36.9,17.9 LDR.2
N$38
  Top 0.406: LDR.1 35.8,25 44.5,25 47,22.5 47.3,22.5 CDS.2
N$39  (via drill 0.6)
  other vias: 31.05,17.8 43.95,26.7
  pour Top: 26.3,15.2 26.4,29 50,29 50.1,15
  pour Bottom: 25.9,28.8 25.9,15.1 49,15 49.9,14.8 49.8,29.1
N$40
  Top 0.406: LINE_SENSOR.1 47.42,3.08 40.78,3.08 R12.2 39.24,2.9 37.71,1.37 33.54,1.37 32.66,2.26 32.66,2.87 OS1.C
N$41
  Bottom 0.965: 72.61,53.24 69.71,50.34
  Bottom 1.016: ULTRASONICSENSOR1.2 | 69.71,50.34 JP43.1 JP36.1 JP45.1 | 72.61,53.24 72.61,53.44
  Bottom 1.27: 72.61,53.44 73.17,54 ULTRASONICSENSOR1.2
N$42
  Top 1.016: JP47.1 JP48.1 JP49.1
  Bottom 1.016: ULTRASONICSENSOR1.3 72.38,57.96 JP47.1
N$43
  Bottom 1.016: JP76.1 65.58,36.34 68.09,36.34 69.33,35.1 ULTRASONICSENSOR2.1
  Bottom 1.676: JP77.1 JP76.1
N$44
  Top 0.61: S3.1 S3.2 | R17.2 73.16,3.46 BUTTON_GREEN.1
  Bottom 0.61: BUTTON_GREEN.1 71.46,3.46 69,1 61.74,1 S3.1
N$45  (via drill 0.9)
  other vias: 64,6
N$46
  pour Top: 52.1,-1 52.1,13 75.6,13.1 75.9,-1.2
  pour Bottom: 52.1,12.3 51.8,-0.7 75.9,-0.1 75.6,13
N$47
  Top 1: 69.79,34.31 72.64,37.16
  Top 1.016: JP79.1 67.61,34.31 69.03,34.31 69.1,34.31 69.79,34.31 | 72.64,37.16 73.27,37.16 ULTRASONICSENSOR2.2
  Bottom 1.016: JP78.1 JP80.1 JP79.1
N$48
  Top 0.61: BUTTON_YELLOW.2 47.4,54 43.75,50.35 R16.1
N$49
  Bottom 1.676: JP81.1 JP83.1 JP82.1 70.88,41.96 72.66,40.18 ULTRASONICSENSOR2.3
N$50
  Top 0.61: BUTTON_GREEN.2 73.45,6 69.75,2.3 R17.1
N$57  (via drill 0.6)
  other vias: 56.9,17.4 69.95,26.4
  pour Top: 52.5,15.25 52.5,28.55 75.85,28.6 75.85,15.25
  pour Bottom: 52.5,28.7 52.5,15.2 75.65,15.2 75.85,28.75
N$58
  Top 0.406: R8.1 R7.1 67.3,22.8 68.75,24.25 71.25,24.25 73.5,22 LINE_SENSOR1.2
N$59
  Top 0.406: R8.2 73.34,19.05 LINE_SENSOR1.1 | OS2.C 59.75,20.27 62.09,20.27 63.31,19.05 65.37,19.05
  Top 0.61: 64.45,19.05 65.37,19.05 R8.2
N$61  (via drill 0.9)
  other vias: 90.1,53.9
N$62
  Top 0.61: OS2.A 60.48,26.5 63.5,26.5 65.3,24.7 R7.2
N$63  (via drill 0.6)
  other vias: 95.8,42.55 82.85,33.5
  pour Bottom: 78.3,44.5 78.4,31.6 101.3,31 101.9,44.7
  pour Top: 78.1,31.4 78.1,44.2 101.8,44.5 101.8,31.3
N$64
  Top 0.406: R19.1 R9.1 92.7,38.75 93.5,38.75 95.25,40.5 96.75,40.5 99.25,38 LINE_SENSOR2.2
N$65
  Top 0.406: R19.2 92.7,35 99.75,35 100,35.25 LINE_SENSOR2.1 | OS3.C 85.7,36.22 88.43,36.22 89.85,34.8 90.2,34.8
  Top 0.61: 90.2,34.8 R19.2
N$66
  Top 0.61: OS3.A 86.09,42.11 88.69,42.11 90.35,40.45 R9.2
N$67  (via drill 0.9)
  other vias: 38,54
  pour Bottom: 25.8,61.2 25.8,46.6 50.3,47.2 49.9,61
  pour Top: 26.1,46.9 26,61 50.1,61.1 49.9,47
N$68  (via drill 0.6)
  Top 0.61: IC2.8 34.29,33.2 35.7,33.2 36.7,34.2 v36.7,35.6 36.7,38.15 R20.1
  Bottom 0.61: v36.7,35.6 45,35.6 46.5,37.1 46.9,37.1 SOUNDSENSOR1.2
N$69
  Top 0.406: C7.1 32.88,42.1 32.88,41.12 34.55,39.45 R20.2
  Top 0.61: 34.55,38.6 R20.2 34.55,38.75 33.7,37.9 32.9,37.9 32.4,37.4 MIC1.1
N$70
  pour Top: 78.45,46.95 78.45,60.85 102,60.5 102,47.2
  pour Bottom: 78.2,61.05 78.4,47.25 102,47.1 102,60.5
N$71
  Top 0.61: IC2.3 38.27,35.73 37.7,36.3 37.7,41.35 36.95,42.1 | R23.2 36.95,42.1 | 36.95,42.1 C7.2
N$72
  Top 0.61: IC2.2 41.81,34.47 R25.2 42.55,35.65 41.6,36.6 41.6,38.35 R24.2

### Text on the board
tPlace: GND | SIGNAL | CUSTOM NODE | +5V | GND | SIGNAL | CUSTOM NODE | +5V
tNames: G | ebots.cc | G | G | ebots.cc | ebots.cc | G | V | V | V | V | TEMPERATURE / SENSOR | S | S | S | S | ebots.cc | G | G | G | V | V | V | RGB LED | IR SENSOR | S | OS3 | S | S | ebots.cc | G | G | G | ebots.cc | ebots.cc | G | V | V | V | BUZZER | V | LED RED | LIGHT / SENSOR | IR SENSOR | S | S | OS2 | S | ebots.cc | ebots.cc | S | ebots.cc | G | G | G | G | ebots.cc | V | V | V | V | GREEN | IR SENSOR | WHITE | S | S | S | S | ebots.cc | ebots.cc
bNames: ebots.cc | SOUND / SENSOR | ebots.cc | G | V | S | ebots.cc